# Altium project NFC Antenna Prototype.PrjPcb
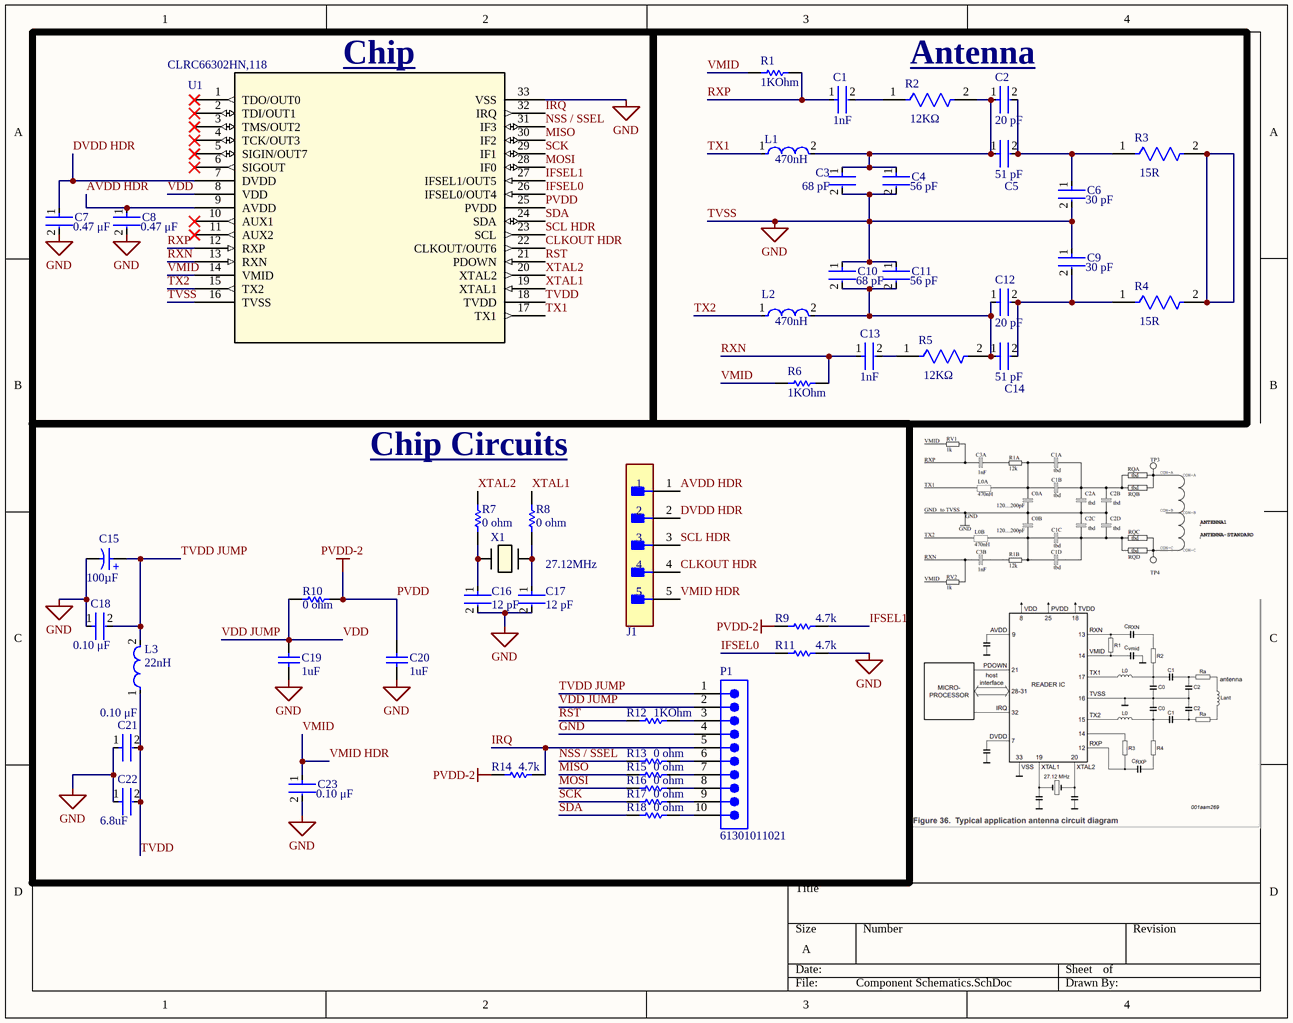
[diagram p0: Component Schematics.SchDoc]
1 sheet, 48 parts. Net scope: global (net labels, ports and power ports of the same name join across sheets).
Board file: NFC Antenna PCB.PcbDoc

## Sheet Component Schematics.SchDoc
size A; SheetNumber: 1; SheetTotal: 1

### Parts
C1  Capacitance: 1nF  [FP-0603-L_1_6_0_15-W_0_81-IPC_A]  (hidden comment: 06035C102KAT2A)
C2  Capacitance: 20 pF  [FP-C0402-BB-MFG]  (hidden comment: C0402C200J5GACTU)
C3  Capacitance: 68 pF  [FP-C0402-BB-MFG]  (hidden comment: C0402C680J5GACTU)
C4  Capacitance: 56 pF  [FP-C0603C-CF-MFG]  (hidden comment: C0603C560J5GACTU)
C5  Capacitance: 51 pF  [FP-C0603C-CF-MFG]  (hidden comment: C0603C510J5GACTU)
C6  value 30 pF  [FP-C0603C-CF-MFG]  (hidden comment: C0603C300J5GACTU)
C7  Capacitance: 0.47 μF  [FP-C0805C-DN-MFG]  (hidden comment: C0805C474K5RACTU)
C8  Capacitance: 0.47 μF  [FP-C0805C-DN-MFG]  (hidden comment: C0805C474K5RACTU)
C9  value 30 pF  [FP-C0603C-CF-MFG]  (hidden comment: C0603C300J5GACTU)
C10  Capacitance: 68 pF  [FP-C0402-BB-MFG]  (hidden comment: C0402C680J5GACTU)
C11  Capacitance: 56 pF  [FP-C0603C-CF-MFG]  (hidden comment: C0603C560J5GACTU)
C12  Capacitance: 20 pF  [FP-C0402-BB-MFG]  (hidden comment: C0402C200J5GACTU)
C13  Capacitance: 1nF  [FP-0603-L_1_6_0_15-W_0_81-IPC_A]  (hidden comment: 06035C102KAT2A)
C14  Capacitance: 51 pF  [FP-C0603C-CF-MFG]  (hidden comment: C0603C510J5GACTU)
C15  Capacitance: 100µF  [WCAP-ASLL_D8H10.5]  (hidden comment: 865060653010)
C16  value 12 pF  [FP-C0603C-CF-MFG]  (hidden comment: C0603C120J5GACTU)
C17  value 12 pF  [FP-C0603C-CF-MFG]  (hidden comment: C0603C120J5GACTU)
C18  Capacitance: 0.10 μF  [FP-C0402-BB-MFG]  (hidden comment: C0402C104K8PACTU)
C19  Capacitance: 1uF  [CAPC3216X110X50LL20T25]  (hidden comment: C1206C105K5RACTU)
C20  Capacitance: 1uF  [CAPC3216X110X50LL20T25]  (hidden comment: C1206C105K5RACTU)
C21  Capacitance: 0.10 μF  [FP-C0402-BB-MFG]  (hidden comment: C0402C104K8PACTU)
C22  Capacitance: 6.8uF  [FP-C4532-250-0_4-IPC_C]  (hidden comment: C4532X7R1H685K250KB)
C23  Capacitance: 0.10 μF  [FP-C0402-BB-MFG]  (hidden comment: C0402C104K8PACTU)
J1  22-28-4050  [FP-22-28-4050-MFG]  (value not drawn)
L1  Inductance: 470nH  [FP-IHLP-2020CZ-FP_1_905x2-MFG]  (hidden comment: IHLP2020CZERR47M01)
L2  Inductance: 470nH  [FP-IHLP-2020CZ-FP_1_905x2-MFG]  (hidden comment: IHLP2020CZERR47M01)
L3  Inductance: 22nH  [FP-LQW18AN_00-MFG]  (hidden comment: LQW18AN22NG00D)
P1  61301011021  [61301011021]
R1  Resistance: 1KOhm  [RESC2013X60X35ML10T20]  (hidden comment: RC0805FR-071KL)
R2  Resistance: 12KΩ  [FP-RT1206-MFG]  (hidden comment: RT1206BRD0712KL)
R3  Resistance: 15R  [FP-CRCW0603-e3-MFG]  (hidden comment: CRCW060315R0FKEA)
R4  Resistance: 15R  [FP-CRCW0603-e3-MFG]  (hidden comment: CRCW060315R0FKEA)
R5  Resistance: 12KΩ  [FP-RT1206-MFG]  (hidden comment: RT1206BRD0712KL)
R6  Resistance: 1KOhm  [RESC2013X60X35ML10T20]  (hidden comment: RC0805FR-071KL)
R7  Resistance: 0 ohm  [RESC1608X55X25ML10T15]  (hidden comment: RC0603JR-070RL)
R8  Resistance: 0 ohm  [RESC1608X55X25ML10T15]  (hidden comment: RC0603JR-070RL)
R9  Resistance: 4.7k  [RESC1608X55X30ML20T10]  (hidden comment: RK73B1JTTD472J)
R10  Resistance: 0 ohm  [RESC1608X55X25ML10T15]  (hidden comment: RC0603JR-070RL)
R11  Resistance: 4.7k  [RESC1608X55X30ML20T10]  (hidden comment: RK73B1JTTD472J)
R12  Resistance: 1KOhm  [RESC3116X65X40ML10T20]  (hidden comment: RC1206FR-071KL)
R13  Resistance: 0 ohm  [RESC1608X55X25ML10T15]  (hidden comment: RC0603JR-070RL)
R14  Resistance: 4.7k  [RESC1608X55X30ML20T10]  (hidden comment: RK73B1JTTD472J)
R15  Resistance: 0 ohm  [RESC1608X55X25ML10T15]  (hidden comment: RC0603JR-070RL)
R16  Resistance: 0 ohm  [RESC1608X55X25ML10T15]  (hidden comment: RC0603JR-070RL)
R17  Resistance: 0 ohm  [RESC1608X55X25ML10T15]  (hidden comment: RC0603JR-070RL)
R18  Resistance: 0 ohm  [RESC1608X55X25ML10T15]  (hidden comment: RC0603JR-070RL)
U1  CLRC66302HN,118  [HVQFN32_SOT617-1_NXP]
X1  Clock Speed: 27.12MHz  [XTAL_LFXTAL0360_IQD]  (hidden comment: LFXTAL036075BULK)

### Blocks framed on the sheet
Chip: C7 C8 U1
Antenna: C1-C6 C9-C14 L1 L2 R1-R6
Chip Circuits: C15-C23 J1 L3 P1 R7-R18 X1

### Nets
GND: C3.2 C4.2 C6.2 C7.2 C8.2 C9.1 C10.1 C11.1 C15.2(N) C16.2 C17.2 C18.1 C19.1 C20.1 C21.1 C22.1 C23.2 P1.4 R11.1 U1.16(TVSS) U1.33(VSS)  [also labelled TVSS]
PVDD: C20.2 R9.2 R10.2 R14.1 U1.25(PVDD)  [also labelled PVDD-2]
AVDD HDR: C8.1 J1.1 U1.9(AVDD)
CLKOUT HDR: J1.4 U1.22(CLKOUT/OUT6)
DVDD HDR: C7.1 J1.2 U1.7(DVDD)
IFSEL0: R11.2 U1.26(IFSEL0/OUT4)
IFSEL1: R9.1 U1.27(IFSEL1/OUT5)
IRQ: P1.5 R14.2 U1.32(IRQ)
MISO: R15.1 U1.30(IF2)
MOSI: R16.1 U1.28(IF0)
NSS / SSEL: R13.1 U1.31(IF3)
RST: R12.1 U1.21(PDOWN)
RXN: C13.1 R6.1 U1.13(RXN)
RXP: C1.1 R1.1 U1.12(RXP)
SCK: R17.1 U1.29(IF1)
SCL HDR: J1.3 U1.23(SCL)
SDA: R18.1 U1.24(SDA)
TVDD: C21.2 C22.2 L3.1 U1.18(TVDD)
TVDD JUMP: C15.1(P) C18.2 L3.2 P1.1
TX1: L1.1 U1.17(TX1)
TX2: L2.1 U1.15(TX2)
VDD: C19.2 P1.2 R10.1 U1.8(VDD)  [also labelled VDD JUMP]
VMID: C23.1 J1.5 R1.2 R6.2 U1.14(VMID)  [also labelled VMID HDR]
XTAL1: R8.1 U1.19(XTAL1)
XTAL2: R7.1 U1.20(XTAL2)
NetC1_2: C1.2 R2.1
NetC2_1: C2.1 C3.1 C4.1 C5.1 L1.2 R2.2
NetC2_2: C2.2 C5.2 C6.1 R3.1
NetC9_2: C9.2 C12.2 C14.2 R4.1
NetC10_2: C10.2 C11.2 C12.1 C14.1 L2.2 R5.2
NetC13_2: C13.2 R5.1
NetC16_1: C16.1 R7.2 X1.1
NetC17_1: C17.1 R8.2 X1.2
NetP1_3: P1.3 R12.2
NetP1_6: P1.6 R13.2
NetP1_7: P1.7 R15.2
NetP1_8: P1.8 R16.2
NetP1_9: P1.9 R17.2
NetP1_10: P1.10 R18.2
NetR3_2: R3.2 R4.2

Not connected (* = marked no-connect by the designer): U1 1(TDO/OUT0)* 2(TDI/OUT1)* 3(TMS/OUT2)* 4(TCK/OUT3)* 5(SIGIN/OUT7)* 6(SIGOUT)* 10(AUX1)* 11(AUX2)*

### Notes on the sheet
- (in symbol CMP-03913-54202488-1) +

### Library data of the parts
C1 C13 = CMP-2006-04378-2: General Purpose Ceramic Capacitor, 0603, 1nF, 10%, X7R, 15%, 50V; Case Code (Metric): 1608; Min Operating Temperature: -55°C; Weight: 7.1E-05oz; Series: -; RoHS Compliant: Yes; Radiation Hardening: No; Height: 0.9mm; Mount: Surface Mount; REACH SVHC: No SVHC; Lead Free: Lead Free; Depth: 0.81mm; Voltage: 50V; Number of Pins: 2; Voltage Rating: 50V; Max Operating Temperature: 125°C; Termination: SMD/SMT; Construction: Flat; Case Code (Imperial): 0603; Dielectric: X7R; Width: 0.032inch; Tolerance: 10%; Case/Package: 0603; Contact Plating: Tin; Packaging: Tape and Reel; Voltage Rating (DC): 50V; Dielectric Material: Ceramic; Package Quantity: 4000; Thickness: 0.035inch; Length: 1.6mm
C2 C12 = CMP-1034-00890-3: CAP CER 20PF 50V 5% NP0 0402; Manufacturer: Kemet; Tolerance: 0.05; Material: Ceramic; Temperature Characteristic: C0G; Temperature Coefficient: 15%; Manufacturer Part Number: C0402C200J5GACTU; Octopart: https://octopart.com/c0402c200j5gactu-kemet-9143900; ComponentLink2Description: Datasheet; RoHS: TRUE; Ipc Land Pattern Name: CAPC10050X50; Temperature: -55°C to +125°C; Lead Free: Yes; Mouser Description: Multilayer Ceramic Capacitors MLCC - SMD/SMT 50volts 20pF C0G 5%; Device Class L1: Passive Components; Category: Cap; Package: C0402-BB; Temperature Range High: +125°C; Voltage Rating: 50 V; Temperature Range Low: -55°C; Device Class L2: Capacitors; Device Class L3: Ceramic Capacitors; Height: 0.55mm; Value: 20 pF; ComponentLink2URL: https://content.kemet.com/datasheets/KEM_C1002_X7R_SMD.pdf; Digikey Description: CAP CER 20PF 50V 5% NP0 0402; Automotive: No
C3 C10 = CMP-1034-01170-4: CAP CER 68PF 50V 5% NP0 0402; Manufacturer: Kemet; Temperature Coefficient: 15%; Tolerance: 0.05; Temperature Characteristic: C0G; Material: Ceramic; Mouser Description: Multilayer Ceramic Capacitors MLCC - SMD/SMT 50volts 68pF C0G 5%; Package: C0402-BB; Automotive: No; Temperature: -55°C to +125°C; RoHS: TRUE; Category: Cap; Value: 68 pF; Height: 0.55mm; Manufacturer Part Number: C0402C680J5GACTU; Lead Free: Yes; Device Class L1: Passive Components; Voltage Rating: 50 V; Device Class L2: Capacitors; Device Class L3: Ceramic Capacitors; ComponentLink2Description: Datasheet; Temperature Range High: +125°C; Octopart: https://octopart.com/c0402c680j5gactu-kemet-127205; ComponentLink2URL: https://content.kemet.com/datasheets/KEM_C1002_X7R_SMD.pdf; Digikey Description: CAP CER 68PF 50V 5% NP0 0402; Temperature Range Low: -55°C; Ipc Land Pattern Name: CAPC10050X50
C4 C11 = CMP-1035-01122-3: CAP CER 56PF 50V C0G/NP0 0603; Manufacturer: KEMET; Temperature Coefficient: 30ppm/°C; Temperature Characteristic: C0G; Material: Ceramic; Tolerance: 0.05; Automotive Grade: Grade 1; Automotive: Yes; Lead Free: Yes; Voltage Rating: 50 V; Package: C0603C-CF; Device Class L1: Passive Components; Octopart: https://octopart.com/c0603c560j5gactu-kemet-107933; Temperature Range High: +125°C; RoHS: TRUE; Device Class L2: Capacitors; Device Class L3: Ceramic Capacitors; Digikey Description: CAP CER 56PF 50V C0G/NP0 0603; Temperature: -55°C to +125°C; Category: Cap; Manufacturer Part Number: C0603C560J5GACTU; Value: 56 pF; ComponentLink2Description: Datasheet; ComponentLink2URL: https://api.kemet.com/component-edge/download/datasheet/C0603C100J5GACAUTO.pdf; Height: 0.87mm; Mouser Description: Cap Ceramic 56pF 50V C0G 5% SMD 0603 125°C Paper T/R; Temperature Range Low: -55°C
C5 C14 = CMP-1035-01095-3: CAP CER 51PF 50V 5% NP0 0603; Manufacturer: KEMET; Tolerance: 0.05; Material: Ceramic; Temperature Characteristic: C0G; Temperature Coefficient: 30ppm/°C; Automotive Grade: Grade 1; ComponentLink2URL: https://api.kemet.com/component-edge/download/datasheet/C0603C100J5GACAUTO.pdf; Package: C0603C-CF; Device Class L2: Capacitors; Mouser Description: Multilayer Ceramic Capacitors MLCC - SMD/SMT 50volts 51pF C0G 5%; Octopart: https://octopart.com/c0603c510j5gactu-kemet-9143750; Voltage Rating: 50 V; ComponentLink2Description: Datasheet; Value: 51 pF; Device Class L3: Ceramic Capacitors; Manufacturer Part Number: C0603C510J5GACTU; Device Class L1: Passive Components; Temperature: -55°C to +125°C; Category: Cap; Temperature Range Low: -55°C; Height: 0.87mm; RoHS: TRUE; Lead Free: Yes; Digikey Description: CAP CER 51PF 50V 5% NP0 0603; Automotive: Yes; Temperature Range High: +125°C
C6 C9 = CMP-1035-00914-3: CAP CER 30PF 50V 5% NP0 0603; Manufacturer: KEMET; Automotive Grade: Grade 1; Temperature Coefficient: 30ppm/°C; Material: Ceramic; Temperature Characteristic: C0G; Tolerance: 0.05; Manufacturer Part Number: C0603C300J5GACTU; ComponentLink2URL: https://api.kemet.com/component-edge/download/datasheet/C0603C100J5GACAUTO.pdf; Automotive: Yes; Device Class L2: Capacitors; Device Class L1: Passive Components; Device Class L3: Ceramic Capacitors; RoHS: TRUE; Octopart: https://octopart.com/c0603c300j5gactu-kemet-199455; Lead Free: Yes; Temperature Range High: +125°C; Category: Cap; Temperature: -55°C to +125°C; Package: C0603C-CF; Capacitance: 30 pF; Digikey Description: CAP CER 30PF 50V 5% NP0 0603; Height: 0.87mm; ComponentLink2Description: Datasheet; Temperature Range Low: -55°C; Mouser Description: Multilayer Ceramic Capacitors MLCC - SMD/SMT 50volts 30pF C0G 5%; Voltage Rating: 50 V
C7 C8 = CMP-2007-03659-2: CAP CER 0.47UF 50V 10% X7R 0805; Manufacturer: KEMET; Temperature Coefficient: 30ppm/°C; Value: 0.47 μF; Tolerance: 0.1; Material: Ceramic; ComponentLink2Description: Datasheet; RoHS: TRUE; Digikey Description: CAP CER 0.47UF 50V 10% X7R 0805; Temperature: -55°C to +125°C; Temperature Range Low: -55°C; Temperature Range High: +125°C; Manufacturer Part Number: C0805C474K5RACTU; Temperature Characteristic: X7R; Height: 0.88mm; Octopart: https://octopart.com/c0805c474k5ractu-kemet-144543; Mouser Description: 0805 C 470nF Ceramic Multilayer Capacitor, 50 VDC, +125degC, X7R Dielec, +/-10%; Device Class L2: Capacitors; Voltage Rating: 50 V; ComponentLink2URL: https://content.kemet.com/datasheets/KEM_C1003_C0G_SMD.pdf; Package: C0805C-DN; Ipc Land Pattern Name: CAPC200125X78; Automotive: No; Device Class L1: Passive Components; Device Class L3: Ceramic Capacitors; Category: Cap; Lead Free: Yes
C15 = CMP-03913-54202488-1: 865060653010 Aluminum Electrolytic Capacitor, Polarized, Aluminum (wet), 50V, 20% +Tol, 20% -Tol, 100uF, Surface Mount, 3333; Leakage Current: 50µA; ESR (Equivalent Series Resistance): 227.529mΩ; Insulation Resistance: 1MΩ; Life (Hours): 5000hours; Polarity: Polar; Impedance: 340mΩ; Ripple Current (AC): 350mA; Min Operating Temperature: -55°C; Voltage Rating: 50V; Voltage Rating (DC): 50V; Height: 10.5mm; Height - Seated (Max): 10.4902mm; Tolerance: 20%; Case/Package: Radial; NexarPartId: 54202488; REACH SVHC: Unknown; Length: 10.5mm; Diameter: 8mm; Packaging: Tape & Reel (TR); RoHS: Compliant; Mount: Surface Mount; Ripple Current: 350mA; Max Operating Temperature: 105°C
C16 C17 = CMP-2006-03703-3: Ceramic Capacitor 12Pf 50V, C0G, 5%, 0603, Full Reel; Manufacturer: KEMET; Automotive Grade: Grade 1; Temperature Coefficient: 30ppm/°C; Tolerance: 0.05; Temperature Range High: +125°C; Temperature Characteristic: C0G; Temperature Range Low: -55°C; Voltage Rating: 50 V; Mouser Description: Ceramic Capacitor 12Pf 50V, C0G, 5%, 0603, Full Reel; Package: C0603C-CF; Temperature: -55°C to +125°C; Device Class L3: Ceramic Capacitors; Material: Ceramic; Lead Free: Yes; ComponentLink2URL: https://api.kemet.com/component-edge/download/datasheet/C0603C100J5GACAUTO.pdf; Category: Cap; Capacitance: 12 pF; ComponentLink2Description: Datasheet; Device Class L1: Passive Components; Height: 0.87mm; Device Class L2: Capacitors; Digikey Description: Ceramic Capacitor 12Pf 50V, C0G, 5%, 0603, Full Reel; RoHS: TRUE; Manufacturer Part Number: C0603C120J5GACTU; Octopart: https://octopart.com/c0603c120j5gactu-kemet-108780; Automotive: Yes
C18 C21 C23 = CMP-2008-02046-2: CAP CER 0.1UF 10V X5R 0402; Manufacturer: Kemet; Material: Ceramic; Temperature Coefficient: 15%; Tolerance: 0.1; Value: 0.10 μF; Package: C0402-BB; Temperature: -55°C to +125°C; ComponentLink2Description: Datasheet; Temperature Characteristic: X5R; Device Class L1: Passive Components; Height: 0.55mm; Lead Free: Yes; ComponentLink2URL: https://content.kemet.com/datasheets/KEM_C1002_X7R_SMD.pdf; Device Class L2: Capacitors; Temperature Range Low: -55°C; Temperature Range High: +125°C; RoHS: TRUE; Octopart: https://octopart.com/c0402c104k8pactu-kemet-140039; Automotive: No; Mouser Description: Capacitor 100 nF 10 VDC 0402; Category: Cap; Voltage Rating: 10 V; Digikey Description: CAP CER 0.1UF 10V X5R 0402; Ipc Land Pattern Name: CAPC10050X50; Device Class L3: Ceramic Capacitors; Manufacturer Part Number: C0402C104K8PACTU
C19 C20 = CMP-2000-06011-1: Chip Capacitor, 1 uF, +/- 10%, 50 V, -55 to 125 degC, 1206 (3216 Metric), RoHS, Tape and Reel; Manufacturer: Kemet; Case Height: 1mm; Dielectric: X7R; Voltage Rating: 50V; Temperature Coefficient / Code: +/-15%; Case Length: 3.2mm; Case Width: 1.6mm; Type: SMDMLCCX7R6.3-250VDCCommericalGrade; Class: Class1; Capacitance - nF: 1000nF; Datasheet URL: http://www.kemet.com/docfinder?Partnumber=C1206C105K5RACTU; Product Category: MultilayerCeramicCapacitorsMLCC-SMD/SMT; Termination Style: SMD/SMT; Dimensions: 1.6mmWx3.2mmLx1mmH; Voltage Rating DC: 50V; Datasheet Version: 02/2016; Packaging: Reel; Brand: Kemet; RoHS: Details; Minimum Operating Temperature: -55C; Operating Temperature Range: -55Cto+125C; Package Reference: 1206; Manufacturer URL: http://www.kemet.com/; Product: GeneralTypeMLCCs; Tolerance: 10%; Package Description: 2-Pin Surface Mount Device, Body 3.2 x 1.6 mm; Mounting Technology: SurfaceMount; Case Code - mm: 3216; Maximum Operating Temperature: +125C; Series: C1206C; Factory Pack Quantity: 2500; Package / Case: 1206(3216metric); Case Code - in: 1206
C22 = CMP-08246-005467-1: Multilayer Ceramic Capacitors 6.8uF ±10% 50V X7R SMD 1812; Length: 4.5mm; Voltage: 50V; Thickness: 0.11inch; Max Operating Temperature: 125°C; RoHS Compliant: Yes; Construction: Flat; Series: C; Termination: SMD/SMT; Resistor Type: Ceramic; Case Code (Imperial): 1812; Height: 2.5mm; Dielectric Material: Ceramic; Voltage Rating (DC): 50V; Packaging: Tape and Reel; Mount: Surface Mount; Voltage Rating: 50V; Package Quantity: 1; Depth: 3.2mm; Tolerance: 10%; Number of Pins: 2; Lead Free: Lead Free; REACH SVHC: No SVHC; Dielectric: X7R; Min Operating Temperature: -55°C; Radiation Hardening: No; Width: 0.126inch; Case Code (Metric): 4532; Weight: 0.000952oz; Case/Package: 1812
J1 = CMP-00257-00278173-1: 22-28-4050 KK® 254 Breakaway Header, Vertical, 5 Circuits, Tin (Sn) Plating, Mating Pin Length 6.09mm; NexarPartId: 278173; Voltage Rating: 250V; Number of Contacts: 5; Contact Resistance: 20mΩ; Gender: Male; Pitch: 2.54mm; Connector Type: Male Pin; Current Rating: 4A; Glow Wire Compliant: Non-compliant; Max Voltage Rating (DC): 250.25kV; Flammability Rating: UL94 V-0; Min Operating Temperature: 0°C; REACH SVHC: Unknown; Lead Free: Lead Free; Termination: Solder; RoHS: Compliant; Schedule B: 8536694040; Number of Circuits: 5; Mount: Through Hole; Lead Pitch: 2.54mm; Height: 2.29mm; Voltage Rating (DC): 250V; Max Operating Temperature: 75°C; Width: 2.49mm; Radiation Hardening: No; Contact Plating: Tin; Orientation: Vertical; Length: 12.7mm; Number of Rows: 1; Housing Material: Thermoplastic; Contact Material: Brass; Packaging: Bulk; Contact Mating Length: 6.096mm; Housing Color: Black; Color: Black; Number of Positions: 5
L1 L2 = CMP-02424-000036-1: Fixed Inductors Commercial High Saturation Series 0.47uH 12.2A 7.04mΩ 20%; Test Frequency: 100kHz; Shielding: Shielded; Core Material: Metal; DC Resistance (DCR): 7.04mR; Saturation Current: 16A; Self Resonant Frequency: 5MHz; Package Quantity: 2000; Depth: 5.43mm; Tolerance: 20%; Min Operating Temperature: -55°C; Height - Seated (Max): 0.118inch; Packaging: Tape and Reel; Current Rating: 12.2A; Length: 5.49mm; Max DC Current: 16A; Termination: SMD/SMT; Mount: Surface Mount; Lead Free: Lead Free; Radiation Hardening: No; Military Standard: Not; Max Operating Temperature: 125°C; Case/Package: 2020; Width: 5.18mm; Height: 3mm
L3 = CMP-06042-008865-1: Wire Wound RF Inductor 22nH ±2% 500mA 0.17Ω 0603 (1608); Test Frequency: 100MHz; Current: 400mA; Series Resistance: 170mR; Core Material: Non-Magnetic; Shielding: Unshielded; Self Resonant Frequency: 4.6GHz; Q Factor: 40; Weight: 0.000106oz; Military Standard: Not; Case/Package: 0603; DC Current: 500mA; Case Code (Metric): 1608; Width: 0.8mm; Length: 1.6mm; Depth: 1mm; REACH SVHC: No SVHC; Tolerance: 2%; Case Code (Imperial): 0603; Lead Free: Lead Free; Mount: Surface Mount; Resistor Type: Wirewound; Inductance Tolerance: 2%; Number of Pins: 2; Termination: SMD/SMT; Package Quantity: 4000; Height - Seated (Max): 0.039inch; Height: 0.8mm; Packaging: Tape and Reel; Max DC Current: 500mA; Current Rating: 500mA; Min Operating Temperature: -55°C; DC Resistance (DCR): 170mR; Max Operating Temperature: 125°C
P1 = CMP-1502-01081-2: NexarPartId: 18818158; Connector Type: Male Pin; Gender: Male; Voltage Rating: 250V; Insulation: Insulated; Contact Resistance: 20mΩ; Pitch: 2.54mm; Current Rating: 3A; Insulation Resistance: 1GΩ; Number of Positions: 10; Housing Material: PBT; Width: 25.4mm; Max Operating Temperature: 125°C; Mount: Through Hole; Contact Mating Length: 5.9944mm; Flammability Rating: UL94 V-0; Number of Pins: 10; RoHS: Compliant; Length: 25.4mm; Packaging: Bulk; Contact Plating: Gold; Termination: Through Hole; Contact Gender: Male; REACH SVHC: Unknown; Color: Black; Contact Material: Copper; Orientation: Right Angle; Operating Supply Voltage: 250V; Min Operating Temperature: -40°C; Number of Contacts: 10; Lead Pitch: 2.54mm; Height: 2.54mm; Number of Rows: 1
R1 R6 = CMP-2100-03671-1: Chip Resistor, 1 KOhm, +/- 1%, 125 mW, -55 to 155 degC, 0805 (2012 Metric), RoHS, Tape and Reel; Manufacturer: Yageo; Temperature Coefficient: 100ppm/degreesC; Voltage Rating (DC): 150V; Max Power Dissipation: 125mW; Number of Pins: 2; Number of Terminations: 2; Datasheet URL: http://www.yageo.com/NewPortal/yageodocoutput?fileName=/pdf/R-Chip/PYu-RC_Group_51_RoHS_L_5.pdf; Length: 0.079inch; Package Description: 2-Pin Surface Mounted Device, Body 2 x 1.25 mm; Depth: 1.25mm; Height: 0.024inch; Military Standard: Not; Case/Package: 0805; Package Reference: 0805; RoHSCompliant: true; Lead Free: LeadFree; Packaging: TapeandReel; Package Quantity: 1; Datasheet Version: Rev. 5, 10/2016; Tolerance: 1%; Min Operating Temperature: -55degC; Voltage Rating: 150V; Composition: ThickFilm; Case Code (Imperial): 0805; Power Rating: 125mW; Width: 0.049inch; Case Code (Metric): 2012; Manufacturer URL: http://www.yageo.com/; Max Operating Temperature: 155degC; REACH SVHC: Unknown; Termination: SMD/SMT
R2 R5 = CMP-2003-04278-2: RES SMD 12K OHM 0.1% 1/4W 1206; Manufacturer: Yageo; Temperature Coefficient: 25 ppm/°C; Value: 12KΩ; Voltage Rating: 200V; Tolerance: 0.005; Power Rating: 0.25W; Height: 0.65mm; Mouser Description: Thin Film Resistors 1/4W 12K ohm .1% 25ppm; Temperature Range High: +155°C; Category: Res; Automotive: No; Octopart: https://octopart.com/rt1206brd0712kl-yageo-1232840; Device Class L3: Chip SMD Resistors; Lead Free: Yes; Series: RT; ComponentLink2URL: http://www.yageo.com/documents/recent/PYu-RT_1-to-0.01_RoHS_L_9.pdf; Device Class L1: Passive Components; ComponentLink2Description: Datasheet; Temperature Range Low: -55°C; Ipc Land Pattern Name: RESC310160X55; Footprint Url: http://www.yageo.com/exep/pages/download/literatures/PYu-R_Mount_10.pdf; Device Class L2: Resistors; Manufacturer Part Number: RT1206BRD0712KL; Temperature: -55°C to +155°C; Composition: Thin Film; RoHS: TRUE; Package: RT1206; Digikey Description: RES SMD 12K OHM 0.1% 1/4W 1206
R3 R4 = CMP-2000-02926-2: RES Thick Film, 15Ω, 1%, 0.1W, 100ppm/°C, 0603; Voltage Rating: 75V; Max Power Dissipation: 100mW; Package Quantity: 10; Width: 0.033inch; Number of Terminations: 2; Contact Plating: Tin; Termination: SMD/SMT; Voltage Rating (DC): 75V; Tolerance: 1%; Temperature Coefficient: 100ppm/°C; Weight: 7.1E-05oz; Mount: Surface Mount; Lead Free: Lead Free; Depth: 0.85mm; Height: 0.45mm; Radiation Hardening: No; Case Code (Imperial): 0603; Packaging: Tape and Reel; Min Operating Temperature: -55°C; Case Code (Metric): 1608; Military Standard: Not; Composition: Thick Film; Case/Package: 0603; Max Operating Temperature: 155°C; Features: Automotive AEC-Q200; Length: 1.55mm; Power Rating: 100mW
R7 R8 R10 R13 R15-R18 = CMP-2100-03667-1: Chip Resistor, 0 Ohm, +/- 5%, 0.1 W, -55 to 155 degC, 0603 (1608 Metric), RoHS, Tape and Reel; Manufacturer: Yageo; Temperature Coefficient: 200ppm/degreesC; Voltage Rating: 50V; Power Rating: 100mW; Width: 0.8mm; Max Operating Temperature: 155degC; Tolerance: 5%; Package Reference: 0603; Height: 0.45mm; Depth: 0.8mm; Package Description: 2-Pin Surface Mount Device, Body 1.6 x 0.8 mm; Termination: SMD/SMT; Package Quantity: 5000; Case/Package: 0603; Case Code (Imperial): 0603; Radiation Hardening: No; Number of Pins: 2; Length: 1.6mm; Lead Free: LeadFree; Voltage Rating (DC): 50V; Military Standard: Not; Datasheet URL: http://www.yageo.com/NewPortal/yageodocoutput?fileName=/pdf/R-Chip/PYu-RC_Group_51_RoHS_L_5.pdf; Manufacturer URL: http://www.yageo.com/; Packaging: TapeandReel; Case Code (Metric): 1608; Min Operating Temperature: -55degC; Composition: ThickFilm; RoHSCompliant: true; Contact Plating: Tin; Datasheet Version: Rev. 5, 10/2016; REACH SVHC: NoSVHC
R9 R11 R14 = CMP-2000-00993-1: Manufacturer: KOA Speer; Part Number: RK73B1JTTD472J
R12 = CMP-2100-03678-1: Chip Resistor, 1 KOhm, +/- 1%, 0.25 W, -55 to 155 degC, 1206 (3216 Metric), RoHS, Tape and Reel; Manufacturer: Yageo; Temperature Coefficient: 100ppm/degreesC; Power Rating: 250mW; Voltage Rating: 200V; Composition: ThickFilm; Min Operating Temperature: -55degC; Tolerance: 1%; REACH SVHC: Unknown; Case Code (Metric): 3216; Military Standard: Not; Datasheet Version: Rev. 5, 10/2016; Package Reference: 1206.0; Case/Package: 1206; Length: 3.1mm; Manufacturer URL: http://www.yageo.com/; Lead Free: LeadFree; RoHSCompliant: true; Termination: SMD/SMT; Packaging: TapeandReel; Package Description: 2-Pin Surface Mount Device, Body 3.1 x 1.6 mm; Depth: 1.6mm; Case Code (Imperial): 1206; Max Operating Temperature: 155degC; Datasheet URL: http://www.yageo.com/NewPortal/yageodocoutput?fileName=/pdf/R-Chip/PYu-RC_Group_51_RoHS_L_5.pdf; Height: 0.55mm
U1 = CLRC66302HN,118: Telecom Circuit, 1-Func, CMOS, PQCC32; Mfr_Name: NXP; Manufacturer: NXP Semiconductors; Package Body Material: Plastic; Number of Functions: 1; Supply Voltage-Nom: 5V; Copyright: Copyright (C) 2023 Ultra Librarian. All rights reserved.; Manufacturer_Part_Number: CLRC66302HN,118; RefDes: RefDes; Type: DEV; Supplier 1: Digi-Key; Manufacturer Part Number: CLRC66302HN,118; RoHS: Yes; Category: RF Semiconductors and Devices; Stock 1: 15797; Pricing 1: 1=10.72, 10=9.696, 25=8.9308, 100=8.1653, 250=7.655, 500=7.14466, 1000=6.78743 (USD); Package Code: HVQCCN; Number of Pins: 32; Package Shape: Square; Min Operating Temperature: -25°C; Max Operating Temperature: 85°C; JESD-30 Code: S-PQCC-N32; Moisture Sensitivity Level: 1; Package Style: CHIP CARRIER, HEAT SINK/SLUG, VERY THIN PROFILEMeter; Surface Mount: Yes; Technology: CMOS; Telecom IC Type: TELECOM CIRCUIT; Terminal Form: No Lead; Terminal Position: QUAD; Length: 5mm; Width: 5mm; Height - Seated (Max): 1mm; Terminal Pitch: 0.5mm; Temperature Grade: OTHER; Reach SVHC Compliant: Yes; RoHS Compliant: Yes; ComponentLink1URL: https://datasheet.ciiva.com:443/pdfs/VipMasterIC/IC/PHGL/PHGLS30447/PHGLS30447-1.pdf?src-supplier=IHS+Markit; ComponentLink1Description: https://datasheet.ciiva.com:443/pdfs/VipMasterIC/IC/PHGL/PHGLS30447/PHGLS30447-1.pdf?src-supplier=IHS+Markit; ComponentLink2URL: https://datasheet.ciiva.com/8149/clrc663-8149081.pdf?src-supplier=Avnet; ComponentLink2Description: https://datasheet.ciiva.com/8149/clrc663-8149081.pdf?src-supplier=Avnet; Supplier Part Number 1: 568-13922-1-ND
X1 = LFXTAL036075BULK: Parallel - Fundamental Quartz Crystal, 27.12MHz Nom; Mfr_Name: IQD Frequency Products; Manufacturer: IQD; Type: DEV; Copyright: Copyright (C) 2023 Ultra Librarian. All rights reserved.; Manufacturer_Part_Number: LFXTAL036075BULK; RefDes: RefDes; Supplier: Digi-Key; Supplier Part Number: 1923-1787-ND; Manufacturer Part Number: LFXTAL036075BULK; RoHS: Yes; Stock: 4877; Pricing: 1=0.5, 10=0.419, 50=0.3772, 100=0.3353, 500=0.31856, 1000=0.26826, 2500=0.25149, 5000=0.24311, 10000=0.23472 (USD); RoHS Compliant: Yes; ComponentLink1URL: https://www.iqdfrequencyproducts.com:443/products/pn/LFXTAL036075Bulk.pdf?src-supplier=IHS+Markit; ComponentLink1Description: https://www.iqdfrequencyproducts.com:443/products/pn/LFXTAL036075Bulk.pdf?src-supplier=IHS+Markit